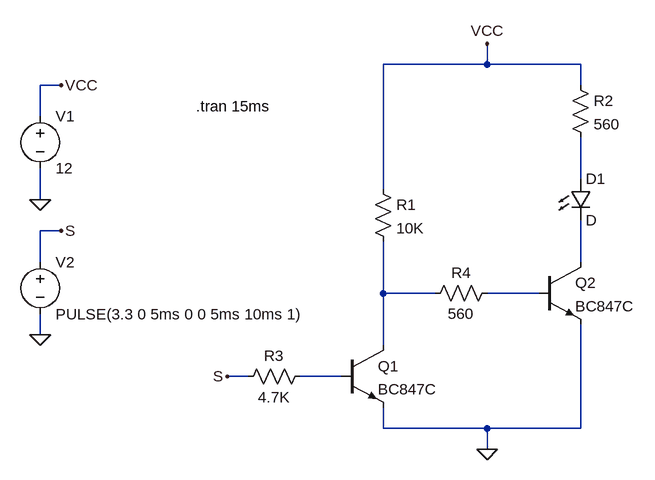
[diagram p0: schematic stepper_leds.asc]
stepper_leds.asc, the LTspice schematic file:
Version 4
SHEET 1 880 680
WIRE 160 -288 160 -320
WIRE 160 -288 0 -288
WIRE 304 -288 160 -288
WIRE -496 -256 -528 -256
WIRE 304 -256 304 -288
WIRE -528 -208 -528 -256
WIRE 304 -112 304 -176
WIRE 0 -96 0 -288
WIRE -528 -80 -528 -128
WIRE -496 -32 -528 -32
WIRE -528 16 -528 -32
WIRE 304 16 304 -48
WIRE 0 64 0 -16
WIRE 80 64 0 64
WIRE 240 64 160 64
WIRE -528 128 -528 96
WIRE 0 144 0 64
WIRE -208 192 -240 192
WIRE -64 192 -128 192
WIRE 0 272 0 240
WIRE 160 272 0 272
WIRE 304 272 304 112
WIRE 304 272 160 272
WIRE 160 304 160 272
FLAG 160 -320 VCC
FLAG 160 304 0
FLAG -240 192 S
FLAG -496 -256 VCC
FLAG -496 -32 S
FLAG -528 -80 0
FLAG -528 128 0
SYMBOL npn -64 144 R0
SYMATTR InstName Q1
SYMATTR Value BC847C
SYMBOL npn 240 16 R0
SYMATTR InstName Q2
SYMATTR Value BC847C
SYMBOL res -16 -112 R0
SYMATTR InstName R1
SYMATTR Value 10K
SYMBOL res 288 -272 R0
SYMATTR InstName R2
SYMATTR Value 560
SYMBOL res -112 176 R90
WINDOW 0 0 56 VBottom 2
WINDOW 3 32 56 VTop 2
SYMATTR InstName R3
SYMATTR Value 4.7K
SYMBOL res 176 48 R90
WINDOW 0 0 56 VBottom 2
WINDOW 3 32 56 VTop 2
SYMATTR InstName R4
SYMATTR Value 560
SYMBOL LED 288 -112 R0
SYMATTR InstName D1
SYMBOL voltage -528 -224 R0
WINDOW 123 0 0 Left 2
WINDOW 39 0 0 Left 2
SYMATTR InstName V1
SYMATTR Value 12
SYMBOL voltage -528 0 R0
WINDOW 123 0 0 Left 2
WINDOW 39 0 0 Left 2
SYMATTR InstName V2
SYMATTR Value PULSE(3.3 0 5ms 0 0 5ms 10ms 1)
TEXT -288 -224 Left 2 !.tran 15ms

The netlist it stands for:
* stepper_leds.asc
Q1 N003 N005 0 0 BC847C
Q2 N002 N004 0 0 BC847C
R1 VCC N003 10K
R2 VCC N001 560
R3 N005 S 4.7K
R4 N004 N003 560
D1 N001 N002 D
V1 VCC 0 12
V2 S 0 PULSE(3.3 0 5ms 0 0 5ms 10ms 1)
.model D D
.lib standard.dio
.model NPN NPN
.model PNP PNP
.lib standard.bjt
.tran 15ms
.backanno
.end